# EAGLE design AD9833_FG_Out (EAGLE 7.2.0)
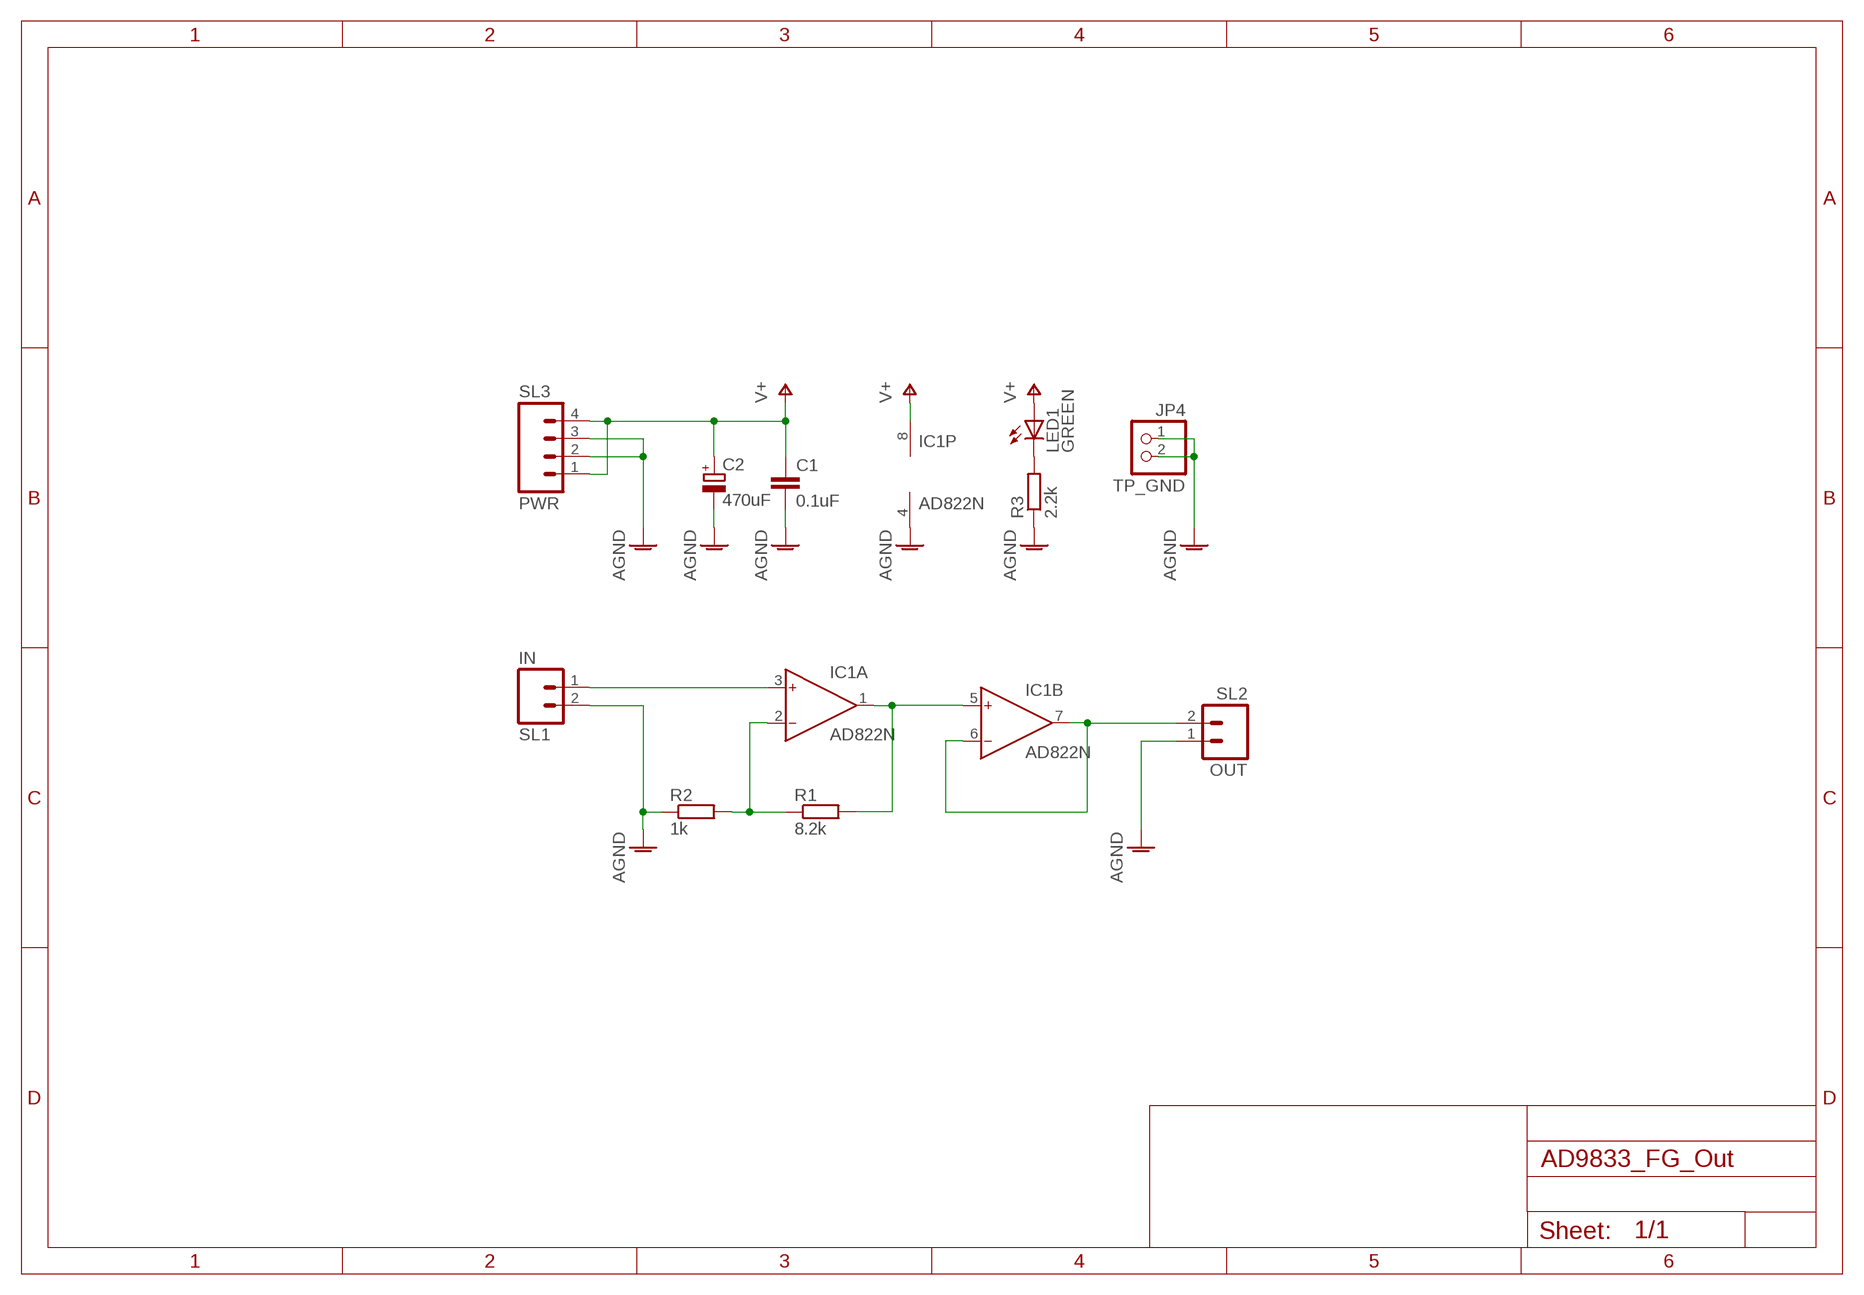
[diagram p0: schematic, sheet 1]

## Parts
C1  0.1uF  C-EU025-024X044  [C025-024X044]
C2  470uF  CPOL-EUE2.5-7  [E2,5-7]
IC1  AD822N  [DIL08]
JP4  TP_GND  PINHD-1X2  [1X02]
LED1  GREEN  LED3MM  [LED3MM]
R1  8.2k  R-EU_0207/7  [0207/7]
R2  1k  R-EU_0207/7  [0207/7]
R3  2.2k  R-EU_0207/7  [0207/7]
SL1  IN  M02  [02P]
SL2  OUT  M02  [02P]
SL3  PWR  M04  [04P]

## Nets
AGND: C1.2 C2.- IC1.4(P:V-) JP4.1 JP4.2 R2.1 R3.1 SL1.2 SL2.1 SL3.2 SL3.3
N$1: IC1.2(A:IN-) R1.1 R2.2
N$2: IC1.3(A:IN+) SL1.1
N$4: IC1.1(A:OUT) IC1.5(B:IN+) R1.2
N$5: IC1.6(B:IN-) IC1.7(B:OUT) SL2.2
N$8: LED1.K(C) R3.2
V+: C1.1 C2.+ IC1.8(P:V+) LED1.A SL3.1 SL3.4

## Library data of the parts
C1 = rcl:C-EU: CAPACITOR, European symbol
C2 = rcl:CPOL-EU: POLARIZED CAPACITOR, European symbol
IC1 = analog-devices:AD822: Single-Supply, Rail-to-Rail Low Power FET-Input Op Amp Source: http://www.analog.com/static/imported-files/data_sheets/AD822.pdf; OC_FARNELL: 1438581; OC_NEWARK: unknown
JP4 = pinhead:PINHD-1X2: PIN HEADER
LED1 = led:LED: LED OSRAM: - CHIPLED LG R971, LG N971, LY N971, LG Q971, LY Q971, LO R971, LY R971 LH N974, LH R974 LS Q976, LO Q976, LY Q976 LO Q996 - Hyper CHIPLED LW Q18S LB Q993, LB Q99A, LB R99A - SideLED LS A670, LO A670, LY A670, LG A670, LP A670 LB A673, LV A673, LT A673, LW A673 LH A674 LY A675 LS A676, LA A676, LO A676, LY A676, LW A676 LS A679, LY A679, LG A679 - Hyper Micro SIDELED® LS Y876, LA Y876, LO Y876, LY Y876 LT Y87S - SmartLED LW L88C, LW L88S LB L89C, LB L89S, LG L890 LS L89K, LO L89K, LY L89K LS L896, LA L896, LO L896, LY L896 - TOPLED LS T670, LO T670, LY T670, LG T670, LP T670 LSG T670, LSP T670, LSY T670, LOP T670, LYG T670 LG T671, LOG T671, LSG T671 LB T673, LV T673, LT T673, LW T673 LH T674 LS T676, LA T676, LO T676, LY T676, LB T676, LH T676, LSB T676, LW T676 LB T67C, LV T67C, LT T67C, LS T67K, LO T67K, LY T67K, LW E67C LS E67B, LA E67B, LO E67B, LY E67B, LB E67C, LV E67C, LT E67C LW T67C LS T679, LY T679, LG T679 LS T770, LO T770, LY T770, LG T770, LP T770 LB T773, LV T773, LT T773, LW T773 LH T774 LS E675, LA E675, LY E675, LS T675 LS T776, LA T776, LO T776, LY T776, LB T776 LHGB T686 LT T68C, LB T68C - Hyper Mini TOPLED® LB M676 - Mini TOPLED Santana® LG M470 LS M47K, LO M47K, LY M47K Source: http://www.osram.convergy.de LUXEON: - LUMILED® LXK2-PW12-R00, LXK2-PW12-S00, LXK2-PW14-U00, LXK2-PW14-V00 LXK2-PM12-R00, LXK2-PM12-S00, LXK2-PM14-U00 LXK2-PE12-Q00, LXK2-PE12-R00, LXK2-PE12-S00, LXK2-PE14-T00, LXK2-PE14-U00 LXK2-PB12-K00, LXK2-PB12-L00, LXK2-PB12-M00, LXK2-PB14-N00, LXK2-PB14-P00, LXK2-PB14-Q00 LXK2-PR12-L00, LXK2-PR12-M00, LXK2-PR14-Q00, LXK2-PR14-R00 LXK2-PD12-Q00, LXK2-PD12-R00, LXK2-PD12-S00 LXK2-PH12-R00, LXK2-PH12-S00 LXK2-PL12-P00, LXK2-PL12-Q00, LXK2-PL12-R00 Source: www.luxeon.com KINGBRIGHT: KA-3528ASYC Source: www.kingbright.com
R1-R3 = rcl:R-EU_: RESISTOR, European symbol
SL1 SL2 = con-amp-quick:M02: AMP QUICK CONNECTOR; OC_FARNELL: unknown; OC_NEWARK: unknown
SL3 = con-amp-quick:M04: AMP QUICK CONNECTOR; OC_FARNELL: unknown; OC_NEWARK: unknown

## Board
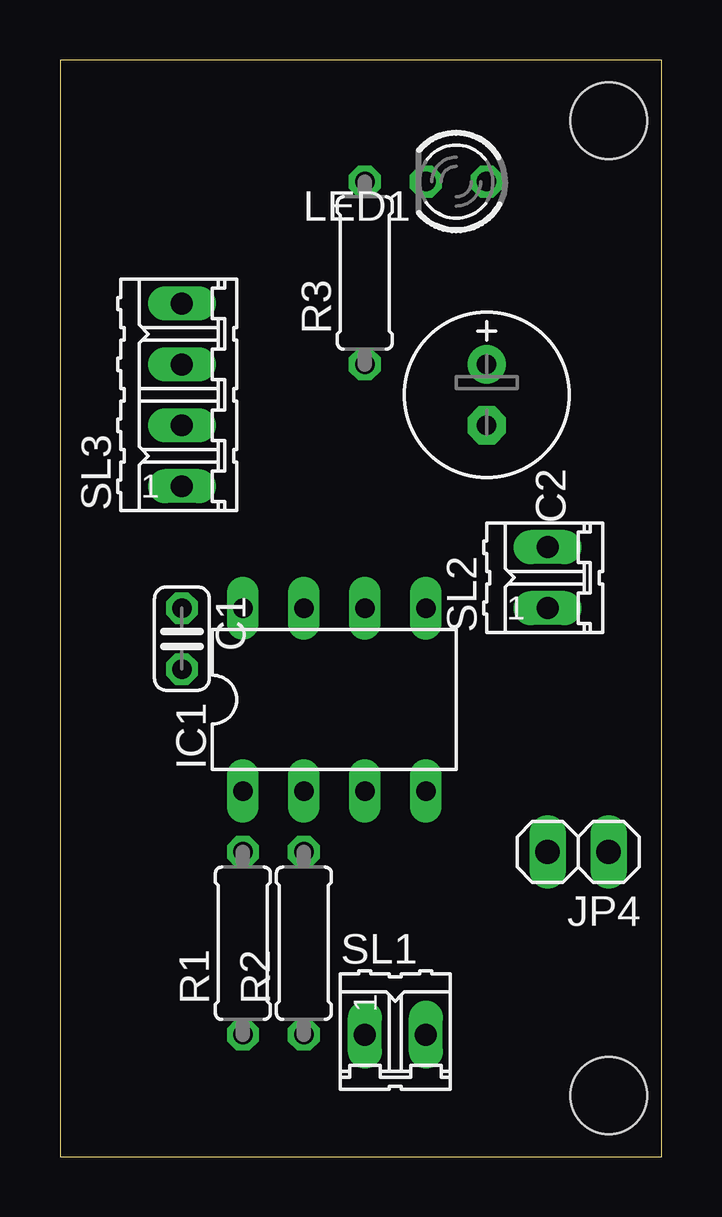
[diagram p1: board, top side]
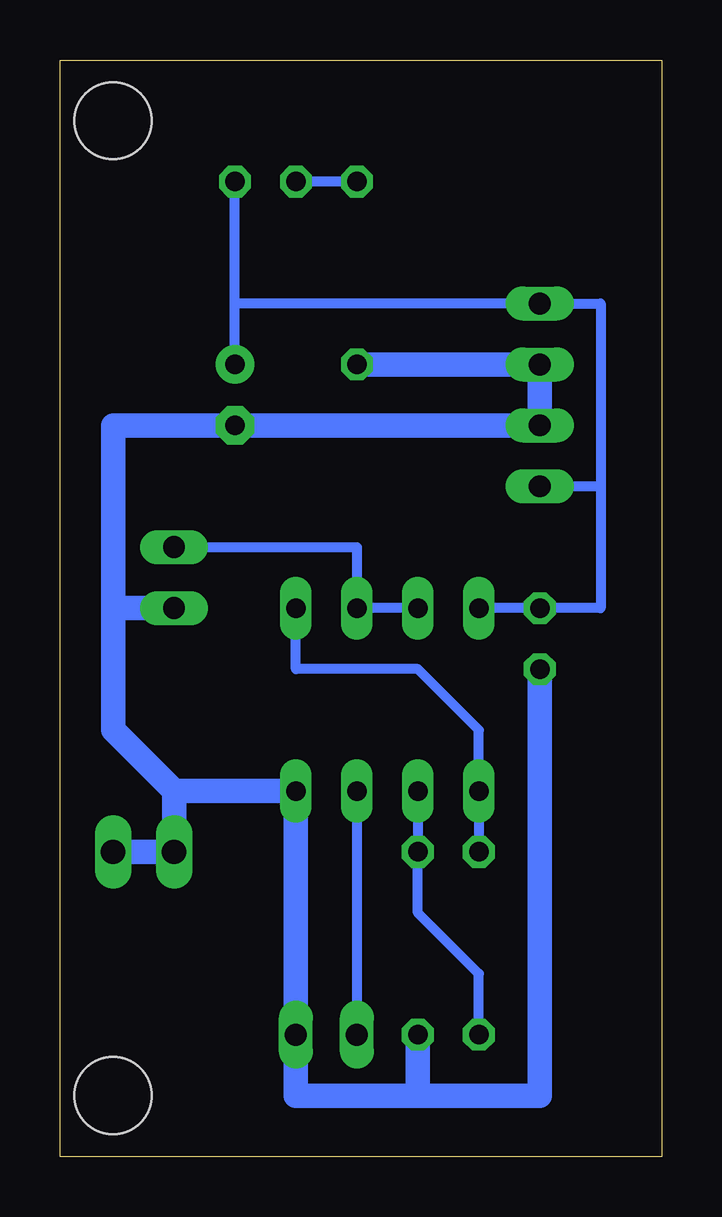
[diagram p2: board, bottom side, seen from below]

Size 25.07 x 45.71 mm. Coordinates in mm from the lower left corner, seen from the top.
Outline: 0,0 25.07,0 25.07,45.71 0,45.71 0,0
Copper layers (1*16): Top 0.035mm / dielectric 1.5mm / Bottom 0.035mm
Design rules "default": minimum track width 10mil, minimum drill 24mil, track to track 8mil, track to pad 8mil, pad to pad 8mil, via to via 8mil, smd to smd 8mil, copper to edge 40mil, drill to drill 8mil, minimum pad ring 10mil, minimum via ring 8mil, stop-mask expansion 4mil, vias tented up to drill 0mil, thermal gap 10mil
Holes 3.2 mm at 22.86,43.18 22.86,2.54

### Footprints (pad centres in the part's own frame; a part is rotated, then mirrored left to right if it is on the bottom)
C025-024X044 = drill 0.813 octagon: 1 -1.27,0; 2 1.27,0
E2,5-7 = drill 0.813 pad 1.6: + -1.27,0 | drill 0.813 pad 1.6 octagon: - 1.27,0
DIL08 = drill 0.813 long: 1 -3.81,-3.81; 2 -1.27,-3.81; 3 1.27,-3.81; 4 3.81,-3.81; 5 3.81,3.81; 6 1.27,3.81; 7 -1.27,3.81; 8 -3.81,3.81
1X02 = drill 1.016 long: 1 -1.27,0; 2 1.27,0
LED3MM = drill 0.813 octagon: A -1.27,0; K 1.27,0
0207/7 = drill 0.813 octagon: 1 -3.81,0; 2 3.81,0
02P = drill 0.914 long: 1 -1.27,0; 2 1.27,0
04P = drill 0.914 long: 1 -3.81,0; 2 -1.27,0; 3 1.27,0; 4 3.81,0

### Placement (x,y rotation side)
C1  5.08,21.59 270 top
C2  17.78,31.75 270 top
IC1  11.43,19.05 0 top
JP4  21.59,12.7 180 top
LED1  16.51,40.64 180 top
R1  7.62,8.89 90 top
R2  10.16,8.89 90 top
R3  12.7,36.83 90 top
SL1  13.97,5.08 0 top
SL2  20.32,24.13 90 top
SL3  5.08,31.75 90 top

### Tracks (layer width: path | path; a pad name or v marks a point on that pad's centre or on a via)
AGND
  Bottom 1.016: R3.1 SL3.3 SL3.2 C2.- 22.86,30.48 22.86,22.86 | 22.86,22.86 22.86,17.78 20.32,15.24 | 20.32,15.24 IC1.4 SL1.2 15.24,2.54 10.16,2.54 | 10.16,2.54 5.08,2.54 C1.2 | SL2.1 22.86,22.86 | R2.1 10.16,2.54 | JP4.1 JP4.2 20.32,15.24
N$1
  Bottom 0.406: IC1.2 R2.2 10.16,10.16 7.62,7.62 R1.1
N$2
  Bottom 0.406: IC1.3 SL1.1
N$4
  Bottom 0.406: IC1.5 15.24,20.32 10.16,20.32 7.62,17.78 IC1.1 R1.2
N$5
  Bottom 0.406: IC1.7 IC1.6 12.7,25.4 SL2.2
N$8
  Bottom 0.406: R3.2 LED1.K
V+
  Bottom 0.406: 2.54,27.94 2.54,35.56 SL3.4 17.78,35.56 | 2.54,27.94 2.54,22.86 C1.1 IC1.8 | SL3.1 2.54,27.94 | 17.78,35.56 LED1.A | C2.+ 17.78,35.56